# Altium schematic sheet WS2812.SchDoc: Smart LED
size B; SheetNumber: 3; SheetTotal: 7
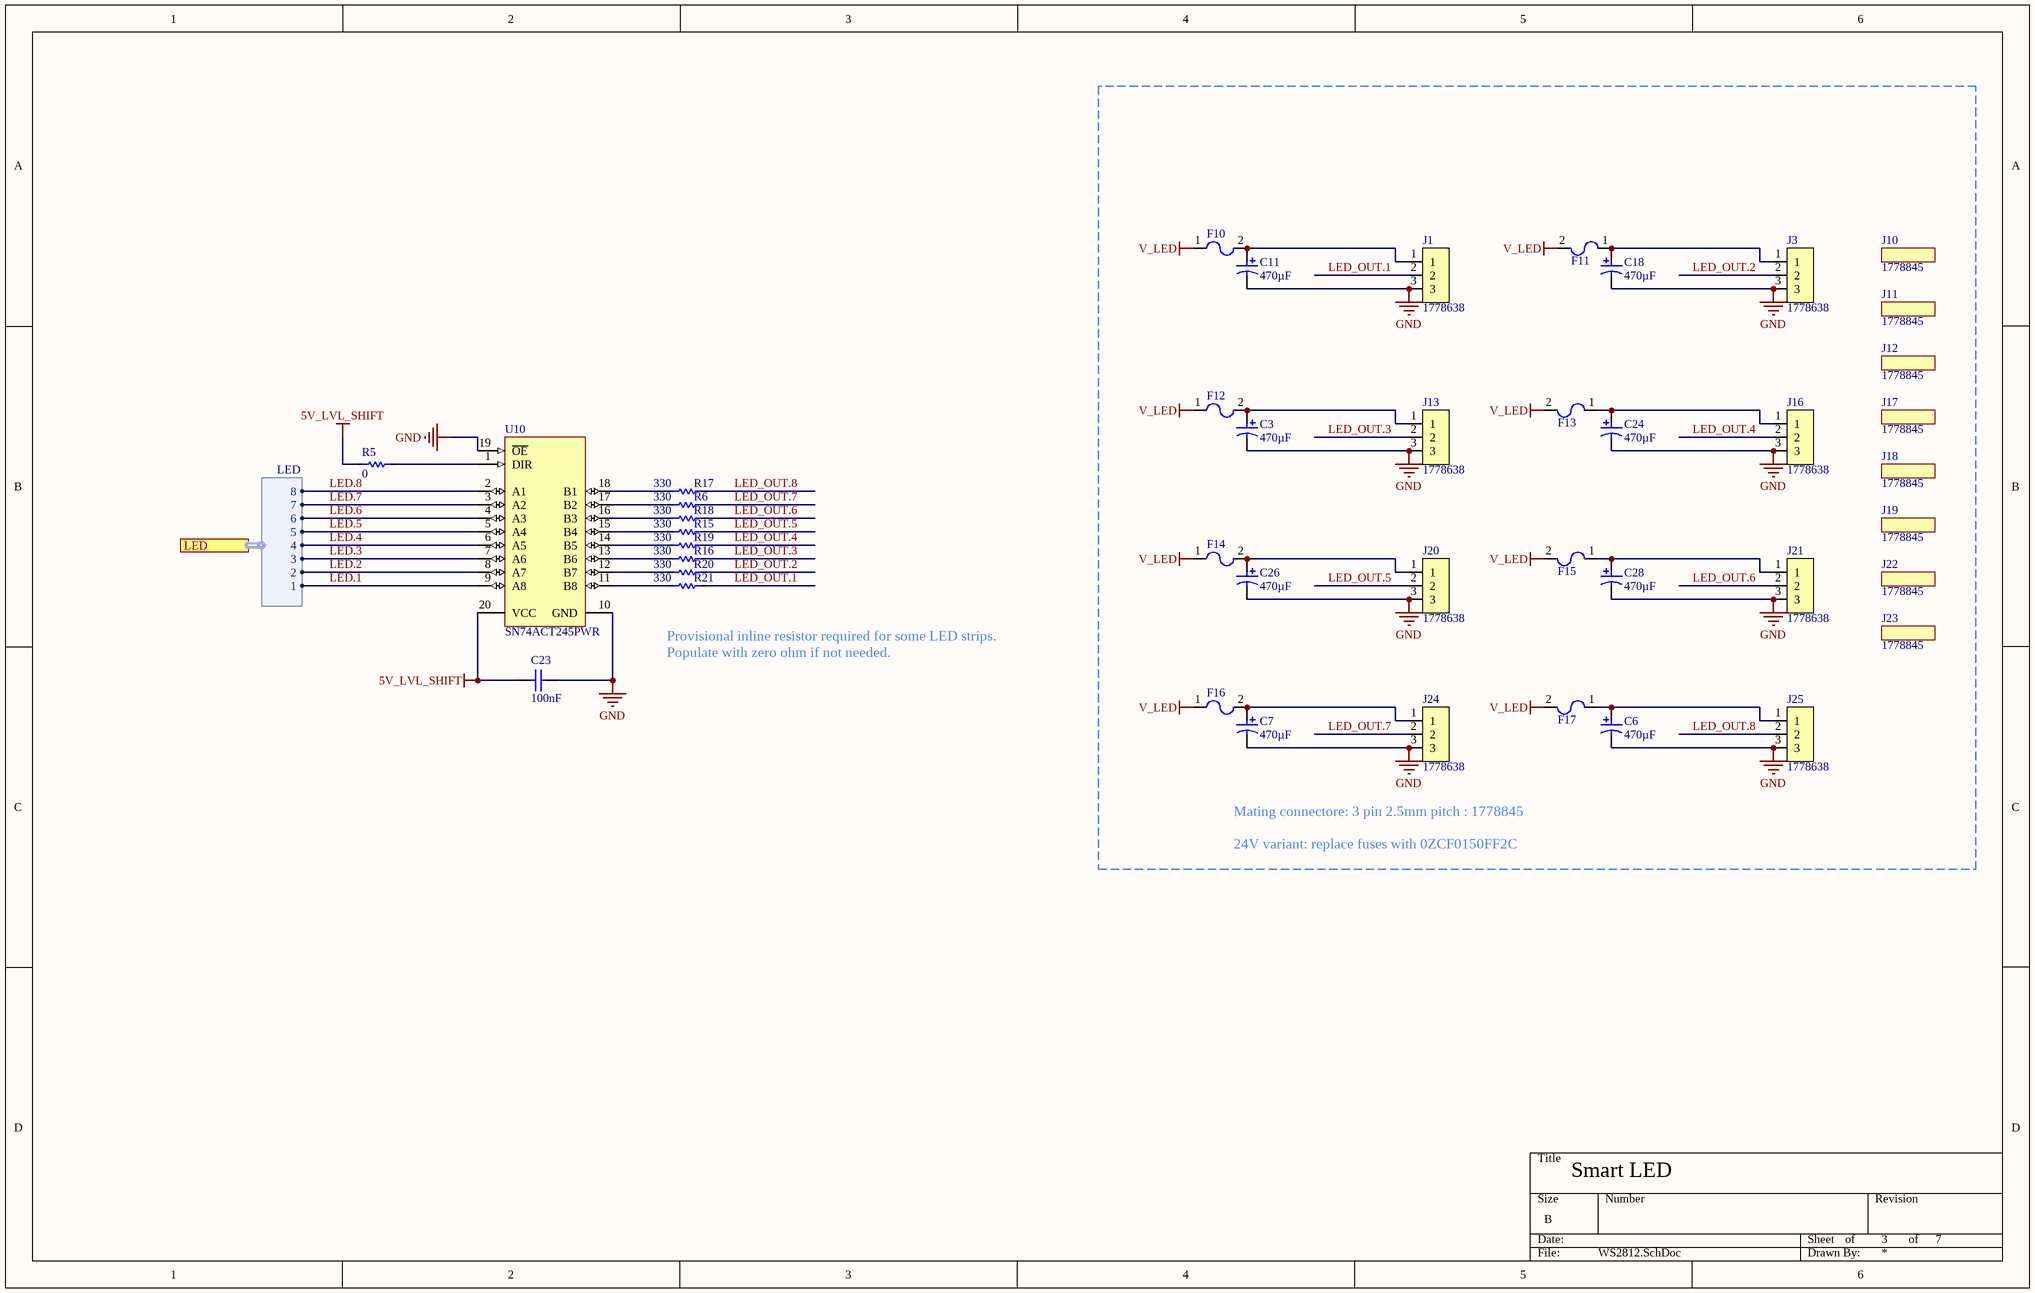
[diagram p0: WS2812.SchDoc]

## Parts
C3  value 470µF  [CAP_POL_DIAM10_H22_SPACING5]  (hidden comment: REH1020471M050K)
C6  value 470µF  [CAP_POL_DIAM10_H22_SPACING5]  (hidden comment: REH1020471M050K)
C7  value 470µF  [CAP_POL_DIAM10_H22_SPACING5]  (hidden comment: REH1020471M050K)
C11  value 470µF  [CAP_POL_DIAM10_H22_SPACING5]  (hidden comment: REH1020471M050K)
C18  value 470µF  [CAP_POL_DIAM10_H22_SPACING5]  (hidden comment: REH1020471M050K)
C23  value 100nF  [CAPC1608X10N_0603_MED]  (hidden comment: CC0603KRX7R0BB104)
C24  value 470µF  [CAP_POL_DIAM10_H22_SPACING5]  (hidden comment: REH1020471M050K)
C26  value 470µF  [CAP_POL_DIAM10_H22_SPACING5]  (hidden comment: REH1020471M050K)
C28  value 470µF  [CAP_POL_DIAM10_H22_SPACING5]  (hidden comment: REH1020471M050K)
F10  0ZCF0300BF2C  [0ZCF0300BF2C-Footprint-1]  (value not drawn)
F11  0ZCF0300BF2C  [0ZCF0300BF2C-Footprint-1]  (value not drawn)
F12  0ZCF0300BF2C  [0ZCF0300BF2C-Footprint-1]  (value not drawn)
F13  0ZCF0300BF2C  [0ZCF0300BF2C-Footprint-1]  (value not drawn)
F14  0ZCF0300BF2C  [0ZCF0300BF2C-Footprint-1]  (value not drawn)
F15  0ZCF0300BF2C  [0ZCF0300BF2C-Footprint-1]  (value not drawn)
F16  0ZCF0300BF2C  [0ZCF0300BF2C-Footprint-1]  (value not drawn)
F17  0ZCF0300BF2C  [0ZCF0300BF2C-Footprint-1]  (value not drawn)
J1  1778638  [1778638-Footprint-1]
J3  1778638  [1778638-Footprint-1]
J10  1778845  [1778845-Footprint-1]  (mechanical)
J11  1778845  [1778845-Footprint-1]  (mechanical)
J12  1778845  [1778845-Footprint-1]  (mechanical)
J13  1778638  [1778638-Footprint-1]
J16  1778638  [1778638-Footprint-1]
J17  1778845  [1778845-Footprint-1]  (mechanical)
J18  1778845  [1778845-Footprint-1]  (mechanical)
J19  1778845  [1778845-Footprint-1]  (mechanical)
J20  1778638  [1778638-Footprint-1]
J21  1778638  [1778638-Footprint-1]
J22  1778845  [1778845-Footprint-1]  (mechanical)
J23  1778845  [1778845-Footprint-1]  (mechanical)
J24  1778638  [1778638-Footprint-1]
J25  1778638  [1778638-Footprint-1]
R5  value 0  [RESC1608X06N_0603_MED]  (hidden comment: RC0603FR-070RL)
R6  value 330  [RESC1608X06N_0603_MED]  (hidden comment: RC0603FR-07330RL)
R15  value 330  [RESC1608X06N_0603_MED]  (hidden comment: RC0603FR-07330RL)
R16  value 330  [RESC1608X06N_0603_MED]  (hidden comment: RC0603FR-07330RL)
R17  value 330  [RESC1608X06N_0603_MED]  (hidden comment: RC0603FR-07330RL)
R18  value 330  [RESC1608X06N_0603_MED]  (hidden comment: RC0603FR-07330RL)
R19  value 330  [RESC1608X06N_0603_MED]  (hidden comment: RC0603FR-07330RL)
R20  value 330  [RESC1608X06N_0603_MED]  (hidden comment: RC0603FR-07330RL)
R21  value 330  [RESC1608X06N_0603_MED]  (hidden comment: RC0603FR-07330RL)
U10  SN74ACT245PWR  [PW0020A_L]

## Ports
LED (harness LED)

## Harnesses
LED: 8, 7, 6, 5, 4, 3, 2, 1

## Nets
5V_LVL_SHIFT: C23.2 R5.2 U10.20(VCC)
GND: C3.2 C6.2 C7.2 C11.2 C18.2 C23.1 C24.2 C26.2 C28.2 J1.3 J3.3 J13.3 J16.3 J20.3 J21.3 J24.3 J25.3 U10.10(GND) U10.19(~{OE})
V_LED: F10.1 F11.2 F12.1 F13.2 F14.1 F15.2 F16.1 F17.2
LED.1: U10.9(A8) ; port LED.1
LED.2: U10.8(A7) ; port LED.2
LED.3: U10.7(A6) ; port LED.3
LED.4: U10.6(A5) ; port LED.4
LED.5: U10.5(A4) ; port LED.5
LED.6: U10.4(A3) ; port LED.6
LED.7: U10.3(A2) ; port LED.7
LED.8: U10.2(A1) ; port LED.8
LED_OUT.1: J1.2 R21.2
LED_OUT.2: J3.2 R20.2
LED_OUT.3: J13.2 R16.2
LED_OUT.4: J16.2 R19.2
LED_OUT.5: J20.2 R15.2
LED_OUT.6: J21.2 R18.2
LED_OUT.7: J24.2 R6.2
LED_OUT.8: J25.2 R17.2
NetC3_1: C3.1 F12.2 J13.1
NetC6_1: C6.1 F17.1 J25.1
NetC7_1: C7.1 F16.2 J24.1
NetC11_1: C11.1 F10.2 J1.1
NetC18_1: C18.1 F11.1 J3.1
NetC24_1: C24.1 F13.1 J16.1
NetC26_1: C26.1 F14.2 J20.1
NetC28_1: C28.1 F15.1 J21.1
NetR5_1: R5.1 U10.1(DIR)
NetR6_1: R6.1 U10.17(B2)
NetR15_1: R15.1 U10.15(B4)
NetR16_1: R16.1 U10.13(B6)
NetR17_1: R17.1 U10.18(B1)
NetR18_1: R18.1 U10.16(B3)
NetR19_1: R19.1 U10.14(B5)
NetR20_1: R20.1 U10.12(B7)
NetR21_1: R21.1 U10.11(B8)

## Notes on the sheet
- Provisional inline resistor required for some LED strips. Populate with zero ohm if not needed.
- Mating connectore: 3 pin 2.5mm pitch : 1778845
  24V variant: replace fuses with 0ZCF0150FF2C
- of

## Library data of the parts
C3 C6 C7 C11 C18 C24 C26 C28 = CMP-001-00166-2: CAP ALUM 470UF 20% 50V RADIAL TH; Capacitor Type: Aluminium; RoHS Compliant: Yes; Case/Package: Radial; Tolerance: 20%; Voltage Rating: 50V; Min Operating Temperature: 125°C; Max Operating Temperature: -40°C; Mounting Technology: Through Hole; Pins: 2
C23 = CMP-001-00102-4: Ceramic Capacitor, Multilayer, Ceramic, 100V, 10% +Tol, 10% -Tol, X7R, 15% TC, 0.1uF, Surface Mount, 0603; Max Operating Temperature: 125°C; RoHS Compliant: Yes; Case/Package: 0603; Mounting Technology: Surface Mount; Capacitor Type: Ceramic; Pins: 2; Voltage Rating: 100V; Min Operating Temperature: -55°C; JLCPN: C113803
F10-F17 = CMP-005-00023-1: Polymeric PTC Resettable Fuse 24V 3 A Ih Surface Mount 2920 (7351 Metric), Conca; Current Rating: 3A; Min Operating Temperature: -40°C; Mounting Technology: Surface Mount; Max Operating Temperature: 85°C
J1 J3 J13 J16 J20 J21 J24 J25 = CMP-002-00251-3: Terminal Block, Header, R/A, 3Way, Th;; Voltage Rating: 160V; Max Current Rating: 6A; Connector Type: Plug; Pins: 3; Mounting Technology: Through Hole
J10-J12 J17-J19 J22 J23 = CMP-002-00252-2: Terminal Block Connector; Plug; Mini; Spring Cage; 3; 2.5 mm; 26-20 AWG; 5 A; 150 V; Connector Type: Socket; Max Current Rating: 6A; Voltage Rating: 160V; Pins: 3; Mounting Technology: Cable, Free Hanging
R5 = CMP-009-00204-6: RC Series 0603 0.1 W 0 Ohm Jumper Surface Mount Thick Film Chip Resistor; Tolerance: 1%; Voltage Rating: 75V; Power: 100mW; Min Operating Temperature: -55°C; Pins: 2; Case/Package: 0603; Max Operating Temperature: 155°C; RoHS Compliant: Yes; Mounting Technology: Surface Mount; JLCPN: C21189
R6 R15-R21 = CMP-009-00302-3: Fixed Resistor, Metal Glaze/thick Film, 0.1W, 330ohm, 75V, 1% +/-Tol, 100ppm/Cel, Surface Mount, 0603; Power: 100mW; Voltage Rating: 50V; Min Operating Temperature: -55°C; Pins: 2; RoHS Compliant: Yes; Tolerance: 1%; Mounting Technology: Surface Mount; Max Operating Temperature: 155°C; Case/Package: 0603; JLCPN: C23138
U10 = CMP-016-00027-3: Bus Transceiver, ACT Series, 1-Func, 8-Bit, True Output, CMOS, PDSO20; Min Supply Voltage: 4.5V; Max Supply Voltage: 5.5V; Nominal Supply Voltage: 5V; Min Operating Temperature: -40°C; RoHS Compliant: Yes; Case/Package: TSSOP; Pins: 20; Max Operating Temperature: 85°C; Logic Type: BUS TRANSCEIVER; JLCPN: C6931